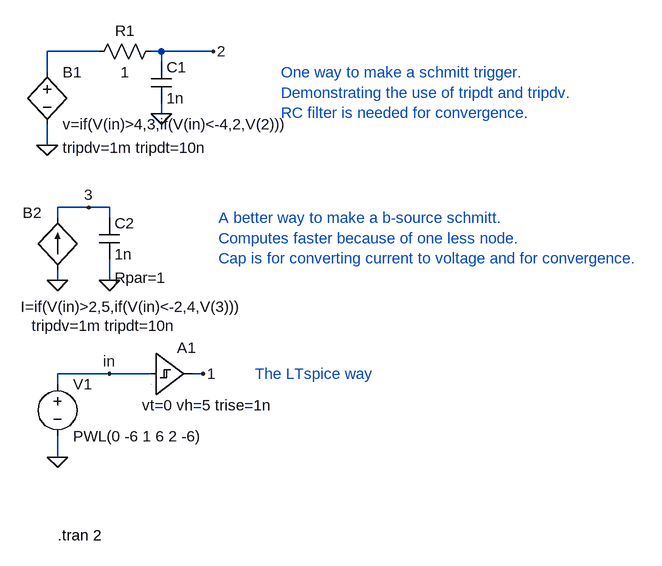
[diagram p0: schematic schmitt.asc]
schmitt.asc, the LTspice schematic file:
Version 4
SHEET 1 932 776
WIRE 16 -240 -64 -240
WIRE 112 -240 96 -240
WIRE 192 -240 112 -240
WIRE 112 -224 112 -240
WIRE -64 -208 -64 -240
WIRE 112 -144 112 -160
WIRE -64 -96 -64 -128
WIRE 0 0 -48 0
WIRE 32 0 0 0
WIRE -48 16 -48 0
WIRE 32 16 32 0
WIRE -48 112 -48 96
WIRE 32 112 32 80
WIRE 32 256 -48 256
WIRE 96 256 32 256
WIRE 176 256 160 256
WIRE -48 272 -48 256
WIRE -48 384 -48 352
FLAG -48 384 0
FLAG 32 256 in
FLAG 176 256 1
FLAG -64 -96 0
FLAG 192 -240 2
FLAG 112 -144 0
FLAG -48 112 0
FLAG 32 112 0
FLAG 0 0 3
SYMBOL Digital\\schmtbuf 96 192 R0
WINDOW 3 -14 112 Left 0
SYMATTR Value vt=0 vh=5 trise=1n
SYMATTR InstName A1
SYMATTR Value2 tripdt=10n
SYMBOL voltage -48 256 R0
WINDOW 123 0 0 Left 0
WINDOW 39 0 0 Left 0
SYMATTR InstName V1
SYMATTR Value PWL(0 -6 1 6 2 -6)
SYMBOL bv -64 -224 R0
WINDOW 123 24 132 Left 0
SYMATTR Value2 tripdv=1m tripdt=10n
SYMATTR InstName B1
SYMATTR Value v=if(V(in)>4,3,if(V(in)<-4,2,V(2)))
SYMBOL res 0 -224 R270
WINDOW 0 32 56 VTop 0
WINDOW 3 0 56 VBottom 0
SYMATTR InstName R1
SYMATTR Value 1
SYMBOL cap 96 -224 R0
SYMATTR InstName C1
SYMATTR Value 1n
SYMBOL bi -48 96 R180
WINDOW 0 24 88 Left 0
WINDOW 3 -287 -57 Left 0
WINDOW 123 -183 -86 Left 0
SYMATTR InstName B2
SYMATTR Value I=if(V(in)>2,5,if(V(in)<-2,4,V(3)))
SYMATTR Value2 tripdv=1m tripdt=10n
SYMBOL cap 16 16 R0
WINDOW 39 24 92 Left 0
SYMATTR InstName C2
SYMATTR Value 1n
SYMATTR SpiceLine Rpar=1
TEXT -48 504 Left 0 !.tran 2
TEXT 296 -208 Left 0 ;One way to make a schmitt trigger.\nDemonstrating the use of tripdt and tripdv.\nRC filter is needed for convergence.
TEXT 200 16 Left 0 ;A better way to make a b-source schmitt.\nComputes faster because of one less node.\nCap is for converting current to voltage and for convergence.
TEXT 256 256 Left 0 ;The LTspice way

The netlist it stands for:
* schmitt.asc
A1 in 0 0 0 0 0 1 0 SCHMITT vt=0 vh=5 trise=1n tripdt=10n
V1 in 0 PWL(0 -6 1 6 2 -6)
B1 N001 0 v=if(V(in)>4,3,if(V(in)<-4,2,V(2))) tripdv=1m tripdt=10n
R1 N001 2 1
C1 2 0 1n
B2 0 3 I=if(V(in)>2,5,if(V(in)<-2,4,V(3))) tripdv=1m tripdt=10n
C2 3 0 1n Rpar=1
.tran 2
* One way to make a schmitt trigger.
* Demonstrating the use of tripdt and tripdv.
* RC filter is needed for convergence.
* A better way to make a b-source schmitt.
* Computes faster because of one less node.
* Cap is for converting current to voltage and for convergence.
* The LTspice way
.backanno
.end